# EAGLE design Smoother (EAGLE 8.2.2)
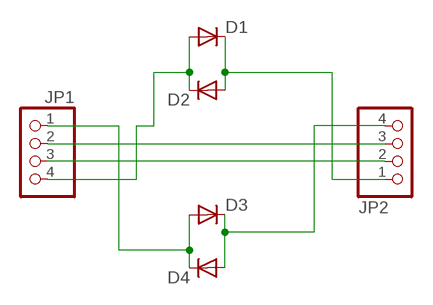
[diagram p0: schematic, sheet 1]

## Parts
D1  DIODE_ES1J  [DO214AC]
D2  DIODE_ES1J  [DO214AC]
D3  DIODE_ES1J  [DO214AC]
D4  DIODE_ES1J  [DO214AC]
JP1  PINHD-1X4/90  [1X04/90]
JP2  PINHD-1X4/90  [1X04/90]

## Nets
N$1: D3.A D4.C JP1.1
N$2: JP1.2 JP2.3
N$3: JP1.3 JP2.2
N$5: D1.C D2.A JP2.1
N$6: D1.A D2.C JP1.4
N$8: D3.C D4.A JP2.4

## Library data of the parts
D1-D4 = Namenlos:DIODE_
JP1 JP2 = pinhead:PINHD-1X4: PIN HEADER

## Board
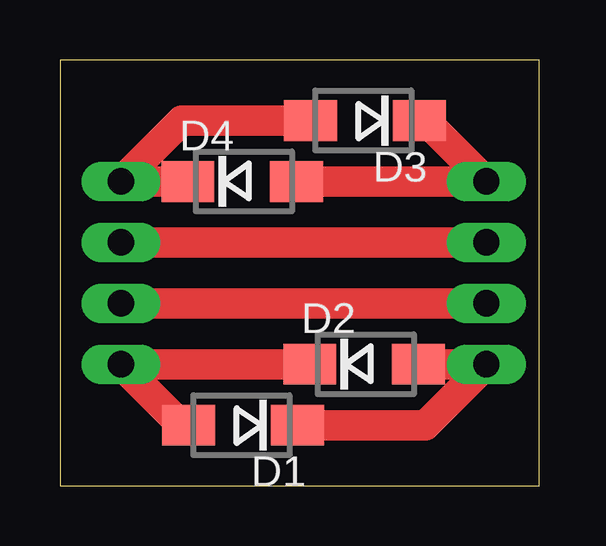
[diagram p1: board, top side]
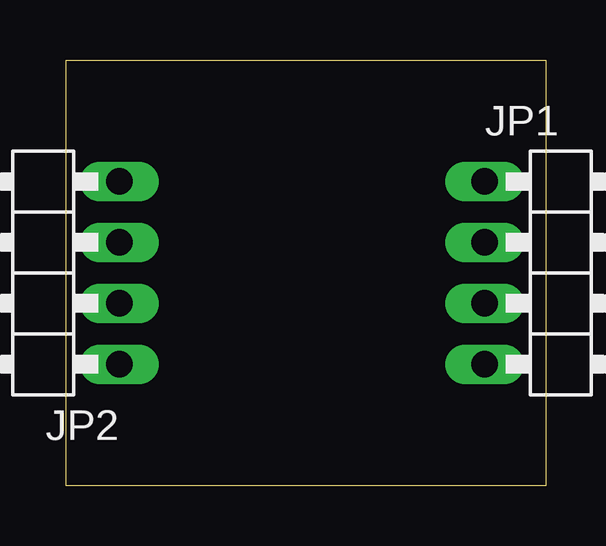
[diagram p2: board, bottom side, seen from below]

Size 19.99 x 17.77 mm. Coordinates in mm from the lower left corner, seen from the top.
Outline: 0,0 19.99,0 19.99,17.77 0,17.77 0,0
Copper layers (1*16): Top 0.035mm / dielectric 1.5mm / Bottom 0.035mm
Design rules "default": minimum track width 6mil, minimum drill 0.35mm, track to track 6mil, track to pad 6mil, pad to pad 6mil, via to via 6mil, smd to smd 6mil, copper to edge 40mil, drill to drill 6mil, minimum pad ring 10mil, minimum via ring 8mil, stop-mask expansion 4mil, vias tented up to drill 0mil, thermal gap 10mil

### Footprints (pad centres in the part's own frame; a part is rotated, then mirrored left to right if it is on the bottom)
DO214AC = smd 2.2 x 1.7: A 2.25,0; C -2.285,0
1X04/90 = drill 1.1 long: 1 -3.81,-3.81; 2 -1.27,-3.81; 3 1.27,-3.81; 4 3.81,-3.81

### Placement (x,y rotation side)
D1  7.62,2.54 180 top
D2  12.7,5.08 0 top
D3  12.7,15.24 180 top
D4  7.62,12.7 0 top
JP1  -1.27,8.89 270 bottom
JP2  21.59,8.89 90 bottom

### Tracks (layer width: path | path; a pad name or v marks a point on that pad's centre or on a via)
N$1
  Top 1.27: D4.C JP1.1 5.08,15.24 D3.A
N$2
  Top 1.27: JP1.2 JP2.3
N$3
  Top 1.27: JP2.2 JP1.3
N$5
  Top 1.27: D2.A JP2.1 15.24,2.54 D1.C
N$6
  Top 1.27: D2.C JP1.4 5.08,2.54 D1.A
N$8
  Top 1.27: D4.A JP2.4 15.24,15.24 D3.C